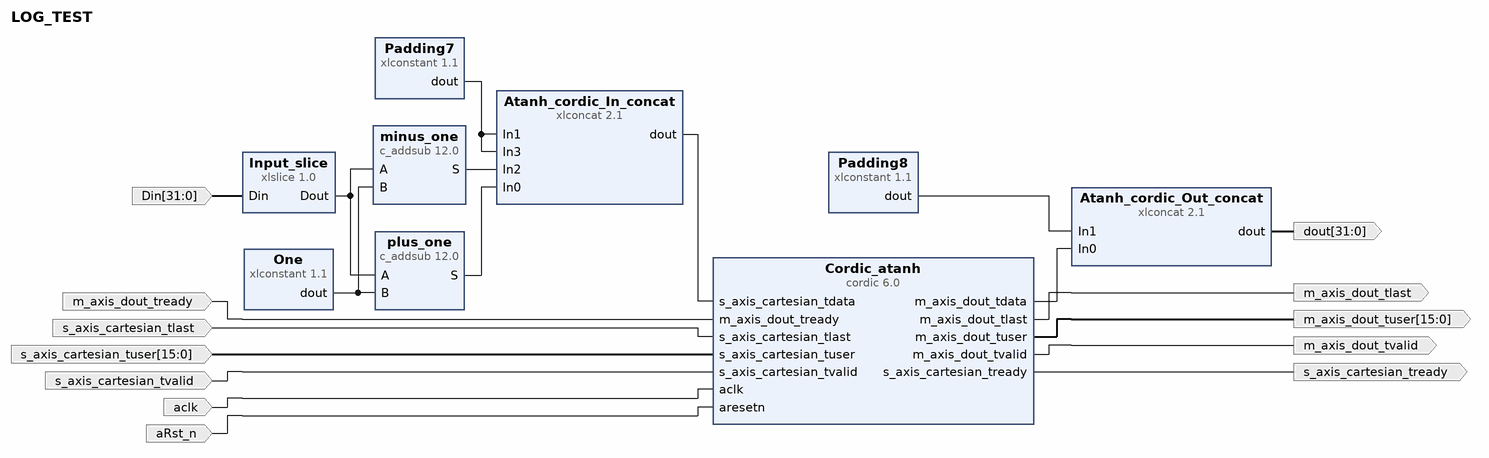
[diagram p0: block diagram of the top level]
# Vivado block design LOG_TEST, xc7z020clg400-1, Vivado 2020.2
create_bd_design LOG_TEST

create_bd_port -dir I -from 31 -to 0 Din
create_bd_port -dir I -type rst aRst_n
create_bd_port -dir I -type clk aclk
create_bd_port -dir O -from 31 -to 0 dout
create_bd_port -dir O m_axis_dout_tlast
create_bd_port -dir I m_axis_dout_tready
create_bd_port -dir O -from 15 -to 0 m_axis_dout_tuser
create_bd_port -dir O m_axis_dout_tvalid
create_bd_port -dir I s_axis_cartesian_tlast
create_bd_port -dir O s_axis_cartesian_tready
create_bd_port -dir I -from 15 -to 0 s_axis_cartesian_tuser
create_bd_port -dir I s_axis_cartesian_tvalid

create_bd_cell -type ip -vlnv xilinx.com:ip:xlconcat:2.1 Atanh_cordic_In_concat
set_property -dict [list \
  CONFIG.IN0_WIDTH 25 \
  CONFIG.IN1_WIDTH 7 \
  CONFIG.IN2_WIDTH 25 \
  CONFIG.IN3_WIDTH 7 \
  CONFIG.NUM_PORTS 4 \
] [get_bd_cells Atanh_cordic_In_concat]
create_bd_cell -type ip -vlnv xilinx.com:ip:xlconcat:2.1 Atanh_cordic_Out_concat
set_property -dict [list \
  CONFIG.IN0_WIDTH 24 \
  CONFIG.IN1_WIDTH 8 \
  CONFIG.IN2_WIDTH 25 \
  CONFIG.IN3_WIDTH 7 \
  CONFIG.NUM_PORTS 2 \
] [get_bd_cells Atanh_cordic_Out_concat]
create_bd_cell -type ip -vlnv xilinx.com:ip:xlslice:1.0 Input_slice
set_property -dict {CONFIG.DIN_FROM 24 CONFIG.DOUT_WIDTH 25} [get_bd_cells Input_slice]
create_bd_cell -type ip -vlnv xilinx.com:ip:xlconstant:1.1 One
set_property -dict {CONFIG.CONST_VAL 1 CONFIG.CONST_WIDTH 1} [get_bd_cells One]
create_bd_cell -type ip -vlnv xilinx.com:ip:xlconstant:1.1 Padding7
set_property -dict {CONFIG.CONST_VAL 0 CONFIG.CONST_WIDTH 7} [get_bd_cells Padding7]
create_bd_cell -type ip -vlnv xilinx.com:ip:xlconstant:1.1 Padding8
set_property -dict {CONFIG.CONST_VAL 0 CONFIG.CONST_WIDTH 8} [get_bd_cells Padding8]
create_bd_cell -type ip -vlnv xilinx.com:ip:cordic:6.0 Cordic_atanh
set_property -dict [list \
  CONFIG.ARESETN true \
  CONFIG.Coarse_Rotation false \
  CONFIG.Data_Format SignedFraction \
  CONFIG.Functional_Selection Arc_Tanh \
  CONFIG.Input_Width 25 \
  CONFIG.Output_Width 24 \
  CONFIG.cartesian_has_tlast true \
  CONFIG.cartesian_has_tuser true \
  CONFIG.cartesian_tuser_width 16 \
  CONFIG.flow_control Blocking \
  CONFIG.out_tlast_behv Pass_Cartesian_TLAST \
  CONFIG.out_tready true \
] [get_bd_cells Cordic_atanh]
create_bd_cell -type ip -vlnv xilinx.com:ip:c_addsub:12.0 minus_one
set_property -dict [list \
  CONFIG.A_Type Unsigned \
  CONFIG.A_Width 25 \
  CONFIG.Add_Mode Subtract \
  CONFIG.B_Type Unsigned \
  CONFIG.B_Width 1 \
  CONFIG.CE false \
  CONFIG.Latency 0 \
  CONFIG.Out_Width 25 \
] [get_bd_cells minus_one]
create_bd_cell -type ip -vlnv xilinx.com:ip:c_addsub:12.0 plus_one
set_property -dict [list \
  CONFIG.A_Type Unsigned \
  CONFIG.A_Width 25 \
  CONFIG.B_Type Unsigned \
  CONFIG.B_Width 1 \
  CONFIG.CE false \
  CONFIG.Latency 0 \
  CONFIG.Out_Width 25 \
] [get_bd_cells plus_one]

# ---- connections ----

connect_bd_net -net Atanh_cordic_concat_dout [get_bd_pins Atanh_cordic_In_concat/dout] [get_bd_pins Cordic_atanh/s_axis_cartesian_tdata]
connect_bd_net -net CORDIC_FIFO_R_s_axis_tready [get_bd_ports m_axis_dout_tready] [get_bd_pins Cordic_atanh/m_axis_dout_tready]
connect_bd_net [get_bd_pins One/dout] [get_bd_pins plus_one/B] [get_bd_pins minus_one/B]
connect_bd_net [get_bd_pins Padding7/dout] [get_bd_pins Atanh_cordic_In_concat/In1] [get_bd_pins Atanh_cordic_In_concat/In3]
connect_bd_net [get_bd_pins Padding8/dout] [get_bd_pins Atanh_cordic_Out_concat/In1]
connect_bd_net -net cordic_0_m_axis_dout_tdata [get_bd_pins Cordic_atanh/m_axis_dout_tdata] [get_bd_pins Atanh_cordic_Out_concat/In0]
connect_bd_net -net cordic_0_m_axis_dout_tlast [get_bd_pins Cordic_atanh/m_axis_dout_tlast] [get_bd_ports m_axis_dout_tlast]
connect_bd_net -net cordic_0_m_axis_dout_tuser [get_bd_pins Cordic_atanh/m_axis_dout_tuser] [get_bd_ports m_axis_dout_tuser]
connect_bd_net -net cordic_0_m_axis_dout_tvalid [get_bd_pins Cordic_atanh/m_axis_dout_tvalid] [get_bd_ports m_axis_dout_tvalid]
connect_bd_net -net cordic_0_s_axis_cartesian_tready [get_bd_pins Cordic_atanh/s_axis_cartesian_tready] [get_bd_ports s_axis_cartesian_tready]
connect_bd_net -net cordic_R_m_axis_dout_tdata [get_bd_ports Din] [get_bd_pins Input_slice/Din]
connect_bd_net -net cordic_R_m_axis_dout_tlast [get_bd_ports s_axis_cartesian_tlast] [get_bd_pins Cordic_atanh/s_axis_cartesian_tlast]
connect_bd_net -net cordic_R_m_axis_dout_tuser [get_bd_ports s_axis_cartesian_tuser] [get_bd_pins Cordic_atanh/s_axis_cartesian_tuser]
connect_bd_net -net cordic_R_m_axis_dout_tvalid [get_bd_ports s_axis_cartesian_tvalid] [get_bd_pins Cordic_atanh/s_axis_cartesian_tvalid]
connect_bd_net [get_bd_pins minus_one/S] [get_bd_pins Atanh_cordic_In_concat/In2]
connect_bd_net [get_bd_pins plus_one/S] [get_bd_pins Atanh_cordic_In_concat/In0]
connect_bd_net -net ps7_0_FCLK_CLK0 [get_bd_ports aclk] [get_bd_pins Cordic_atanh/aclk]
connect_bd_net -net rst_ps7_0_fclk0_peripheral_aresetn [get_bd_ports aRst_n] [get_bd_pins Cordic_atanh/aresetn]
connect_bd_net -net xlslice_0_Dout1 [get_bd_pins Input_slice/Dout] [get_bd_pins plus_one/A] [get_bd_pins minus_one/A]
connect_bd_net [get_bd_pins Atanh_cordic_Out_concat/dout] [get_bd_ports dout]

validate_bd_design
save_bd_design
